# EAGLE design PolluxSensorDust (EAGLE 6.1)
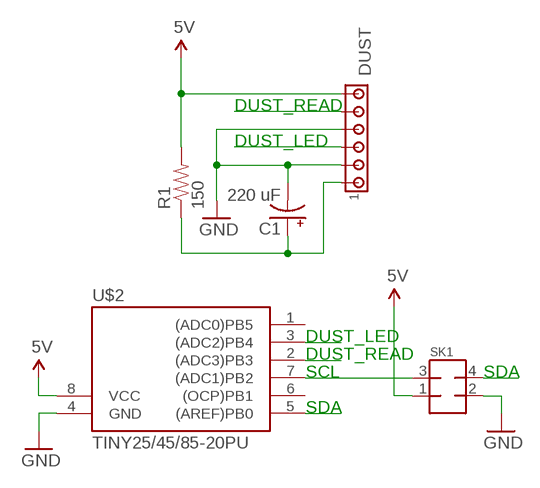
[diagram p0: schematic, sheet 1]

## Parts
C1  220 uF  CAP_POLPTH4  [CPOL-RADIAL-1000UF-25V]
DUST  MTA06-100  [10X06MTA]
R1  150  RESISTORAXIAL-0.3  [AXIAL-0.3]
SK1  MMATCH-8-PTH  [AMP-215079-8]
U$2  TINY25/45/85-20PU  [DIL08]

## Nets
5V: DUST.1 R1.P$2 SK1.1 U$2.8(VCC)
DUST_LED: DUST.4 U$2.3((ADC2)PB4)
DUST_READ: DUST.2 U$2.2((ADC3)PB3)
GND: C1.2(-) DUST.3 DUST.5 SK1.2 U$2.4(GND)
N$1: SK1.3 U$2.7((ADC1)PB2)
N$4: C1.1(+) DUST.6 R1.P$1
SDA: SK1.4 U$2.5((AREF)PB0)
Unconnected: U$2.1((ADC0)PB5) U$2.6((OCP)PB1)

## Notes on the sheet
- DUST_READ
- DUST_LED
- DUST_LED
- DUST_READ
- SCL | SDA
- SDA

## Library data of the parts
C1 = SparkFun:CAP_POL: Capacitor Polarized These are standard SMD and PTH capacitors. Normally 10uF, 47uF, and 100uF in electrolytic and tantalum varieties. Always verify the external diameter of the through hole cap, it varies with capacity, voltage, and manufacturer. The EIA devices should be standard.
DUST = con-amp:MTA06-100: AMP connector
R1 = SparkFun:RESISTOR: Resistor Basic schematic elements and footprints for 0603, 1206, and PTH resistors.
SK1 = jt-con-micromatch:MMATCH-8-*: AMP Micromatch 8-pin
U$2 = avr-7:TINY25/45/85

## Board
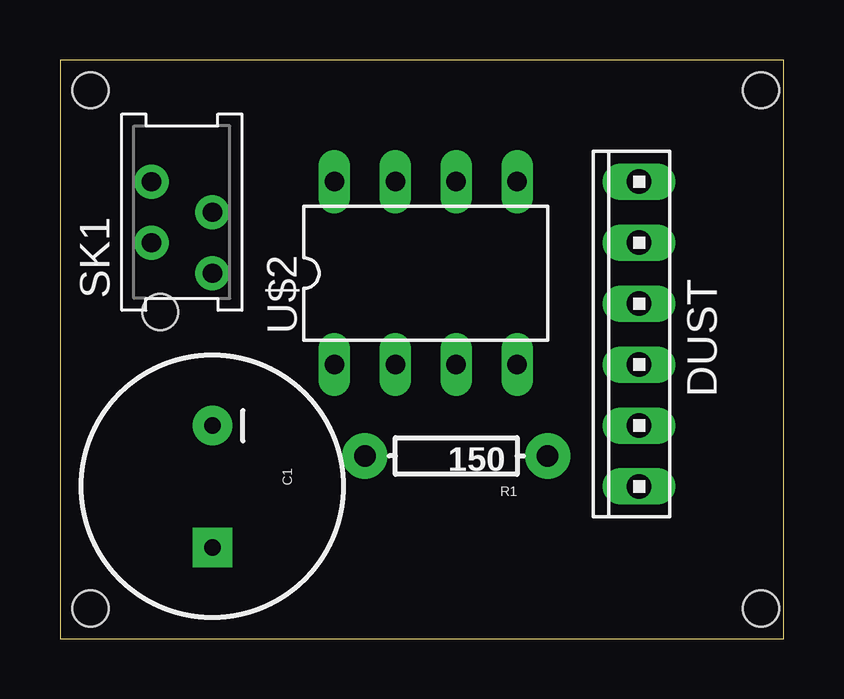
[diagram p1: board, top side]
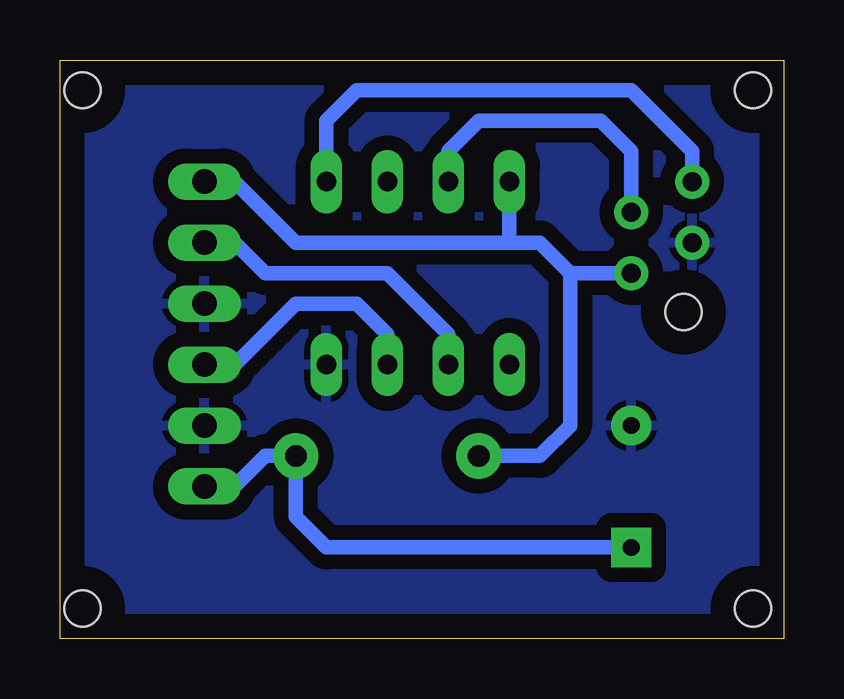
[diagram p2: board, bottom side, seen from below]

Size 30.15 x 24.12 mm. Coordinates in mm from the lower left corner, seen from the top.
Outline: 0,0 30.15,0 30.15,24.12 0,24.12 0,0
Copper layers (1*16): Top 0.035mm / dielectric 1.5mm / Bottom 0.035mm
Design rules: minimum track width 24mil, minimum drill 24mil, track to track 24mil, track to pad 24mil, pad to pad 8mil, via to via 8mil, smd to smd 8mil, copper to edge 40mil, drill to drill 8mil, minimum pad ring 10mil, minimum via ring 8mil, stop-mask expansion 4mil, vias tented up to drill 0mil, thermal gap 10mil
Holes 1.5 mm at 29.21,1.27 1.27,1.27 29.21,22.86 1.27,22.86

### Footprints (pad centres in the part's own frame; a part is rotated, then mirrored left to right if it is on the bottom)
CPOL-RADIAL-1000UF-25V = drill 0.7 pad 1.651 square: 1 2.54,0 | drill 0.7 pad 1.651: 2 -2.54,0
10X06MTA = drill 1.016 long: 1 6.35,0; 2 3.81,0; 3 1.27,0; 4 -1.27,0; 5 -3.81,0; 6 -6.35,0
AXIAL-0.3 = drill 0.9 pad 1.88: P$1 -3.81,0; P$2 3.81,0
AMP-215079-8 = drill 0.8 pad 1.422: 1 0,-1.27; 2 1.27,1.27; 3 2.54,-1.27; 4 3.81,1.27 | hole 1.5: -1.62,0.905
DIL08 = drill 0.813 long: 1 -3.81,-3.81; 2 -1.27,-3.81; 3 1.27,-3.81; 4 3.81,-3.81; 5 3.81,3.81; 6 1.27,3.81; 7 -1.27,3.81; 8 -3.81,3.81

### Placement (x,y rotation side)
C1  6.35,6.35 270 top
DUST  24.13,12.7 90 top
R1  16.51,7.62 180 top
SK1  5.08,15.24 90 top
U$2  15.24,15.24 0 top

### Tracks (layer width: path | path; a pad name or v marks a point on that pad's centre or on a via)
5V
  Bottom 0.61: SK1.1 8.89,15.24 | 11.43,16.51 10.16,16.51 8.89,15.24 | 11.43,16.51 20.32,16.51 22.86,19.05 DUST.1 | 8.89,15.24 8.89,8.89 10.16,7.62 R1.P$2 | 11.43,16.51 U$2.8
DUST_LED
  Bottom 0.61: U$2.3 16.51,12.7 17.78,13.97 20.32,13.97 22.86,11.43 DUST.4
DUST_READ
  Bottom 0.61: DUST.2 22.86,16.51 21.59,15.24 16.51,15.24 13.97,12.7 U$2.2
GND
  pour Bottom: 0,24.13 30.48,24.13 30.48,0 0,0
N$1
  Bottom 0.61: SK1.3 6.35,20.32 7.62,21.59 12.7,21.59 13.97,20.32 U$2.7
N$4
  Bottom 0.61: C1.1 19.05,3.81 20.32,5.08 R1.P$1 21.59,7.62 22.86,6.35 DUST.6
SDA
  Bottom 0.61: SK1.4 3.81,20.32 6.35,22.86 17.78,22.86 19.05,21.59 U$2.5